# Altium schematic sheet PART8_Volt_Multipl.SchDoc
size A4
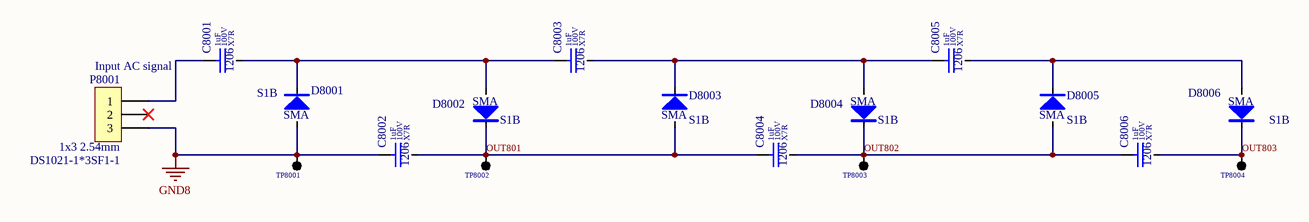
[diagram p0: PART8_Volt_Multipl.SchDoc]

## Parts
C8001  value 1uF  Dielectric: X7R  Voltage: 100V  SCH_Footprint: 1206  [C_1206_3216]  (hidden comment: Ceramic X7R)
C8002  value 1uF  Dielectric: X7R  Voltage: 100V  SCH_Footprint: 1206  [C_1206_3216]  (hidden comment: Ceramic X7R)
C8003  value 1uF  Dielectric: X7R  Voltage: 100V  SCH_Footprint: 1206  [C_1206_3216]  (hidden comment: Ceramic X7R)
C8004  value 1uF  Dielectric: X7R  Voltage: 100V  SCH_Footprint: 1206  [C_1206_3216]  (hidden comment: Ceramic X7R)
C8005  value 1uF  Dielectric: X7R  Voltage: 100V  SCH_Footprint: 1206  [C_1206_3216]  (hidden comment: Ceramic X7R)
C8006  value 1uF  Dielectric: X7R  Voltage: 100V  SCH_Footprint: 1206  [C_1206_3216]  (hidden comment: Ceramic X7R)
D8001  value S1B  SCH_Footprint: SMA  [SMA_DO-214AC]
D8002  value S1B  SCH_Footprint: SMA  [SMA_DO-214AC]
D8003  value S1B  SCH_Footprint: SMA  [SMA_DO-214AC]
D8004  value S1B  SCH_Footprint: SMA  [SMA_DO-214AC]
D8005  value S1B  SCH_Footprint: SMA  [SMA_DO-214AC]
D8006  value S1B  SCH_Footprint: SMA  [SMA_DO-214AC]
P8001  Input AC signal  value DS1021-1*3SF1-1  SCH_Footprint: 1x3 2.54mm  [P_HEADER_1x3_2.54]
TP8001  Single pin  [TP_1PIN]  (value not drawn)
TP8002  Single pin  [TP_1PIN]  (value not drawn)
TP8003  Single pin  [TP_1PIN]  (value not drawn)
TP8004  Single pin  [TP_1PIN]  (value not drawn)

## Nets
GND8: C8002.1 D8001.2 P8001.3 TP8001.1(TP)
OUT801: C8002.2 C8004.1 D8002.1 D8003.2 TP8002.1(TP)
OUT802: C8004.2 C8006.1 D8004.1 D8005.2 TP8003.1(TP)
OUT803: C8006.2 D8006.1 TP8004.1(TP)
NetC8001_1: C8001.1 P8001.1
NetC8001_2: C8001.2 C8003.1 D8001.1 D8002.2
NetC8003_2: C8003.2 C8005.1 D8003.1 D8004.2
NetC8005_2: C8005.2 D8005.1 D8006.2

Not connected (* = marked no-connect by the designer): P8001 2*

## Library data of the parts
C8001-C8006 = C_1uF_100V_X7R_1206_10: Capacitor; Manufacturer: AVX; Manufacturer Part Number: 12061C105K4Z2A; Tolerance (%): 10; Part Number: C_1uF_100V_X7R_1206_10; HelpURL: https://www.tme.eu/Document/943bdb20b23b898c4d4b2ec4eca4f2b6/cauto.pdf; Supplier 1: TME; Supplier Part Number 1: 12061C105K4Z2A; Supplier 2: RS Components; Supplier Part Number 2: 136-4280; Supplier 3: Farnell; Supplier Part Number 3: 1833855; Supplier 4: Mouser; Supplier Part Number 4: 581-12061C105K4Z2A; Supplier 5: Digi-Key; Supplier Part Number 5: 478-9923-1-ND
D8001-D8006 = D_S1B_1A_100V_SMA: Manufacturer: Vishay/General Semiconductor; Voltage: 100V; Current: 1A; Part Number: D_S1B_1A_100V_SMA; Manufacturer Part Number: S1B; Supplier 1: TME; Supplier 2: RS Components; Supplier 3: Farnell; Supplier 4: Mouser; Supplier Part Number 4: 821-S1B; Supplier 5: Digi-Key; Supplier Part Number 5: S1B/51GI
P8001 = P_HEADER_1x3_2.54: Pin Header; Manufacturer: Connfly; Part Number: P_HEADER_1x3_2.54; Component Type: Standard; HelpURL: http://www.tme.eu/en/Document/cc301e58a5da78cb543a94b5a5b7f06a/DS1021.pdf; Manufacturer Part Number: DS1021-1*3SF1-1; Supplier 1: TME; Supplier Part Number 1: ZL201-03G; Supplier 2: RS Components; Supplier 3: Farnell; Supplier 4: Mouser; Supplier 5: Digi-Key
TP8001-TP8004 = TP_1PIN: Testpoint; SCH_Footprint: Single; Part Number: TP_1PIN; Component Type: Standard; Supplier 1: TME; Supplier 2: RS Components; Supplier 3: Farnell; Supplier 4: Mouser; Supplier 5: Digi-Key